# EAGLE design Control Board v1.1 (EAGLE 7.7.0)
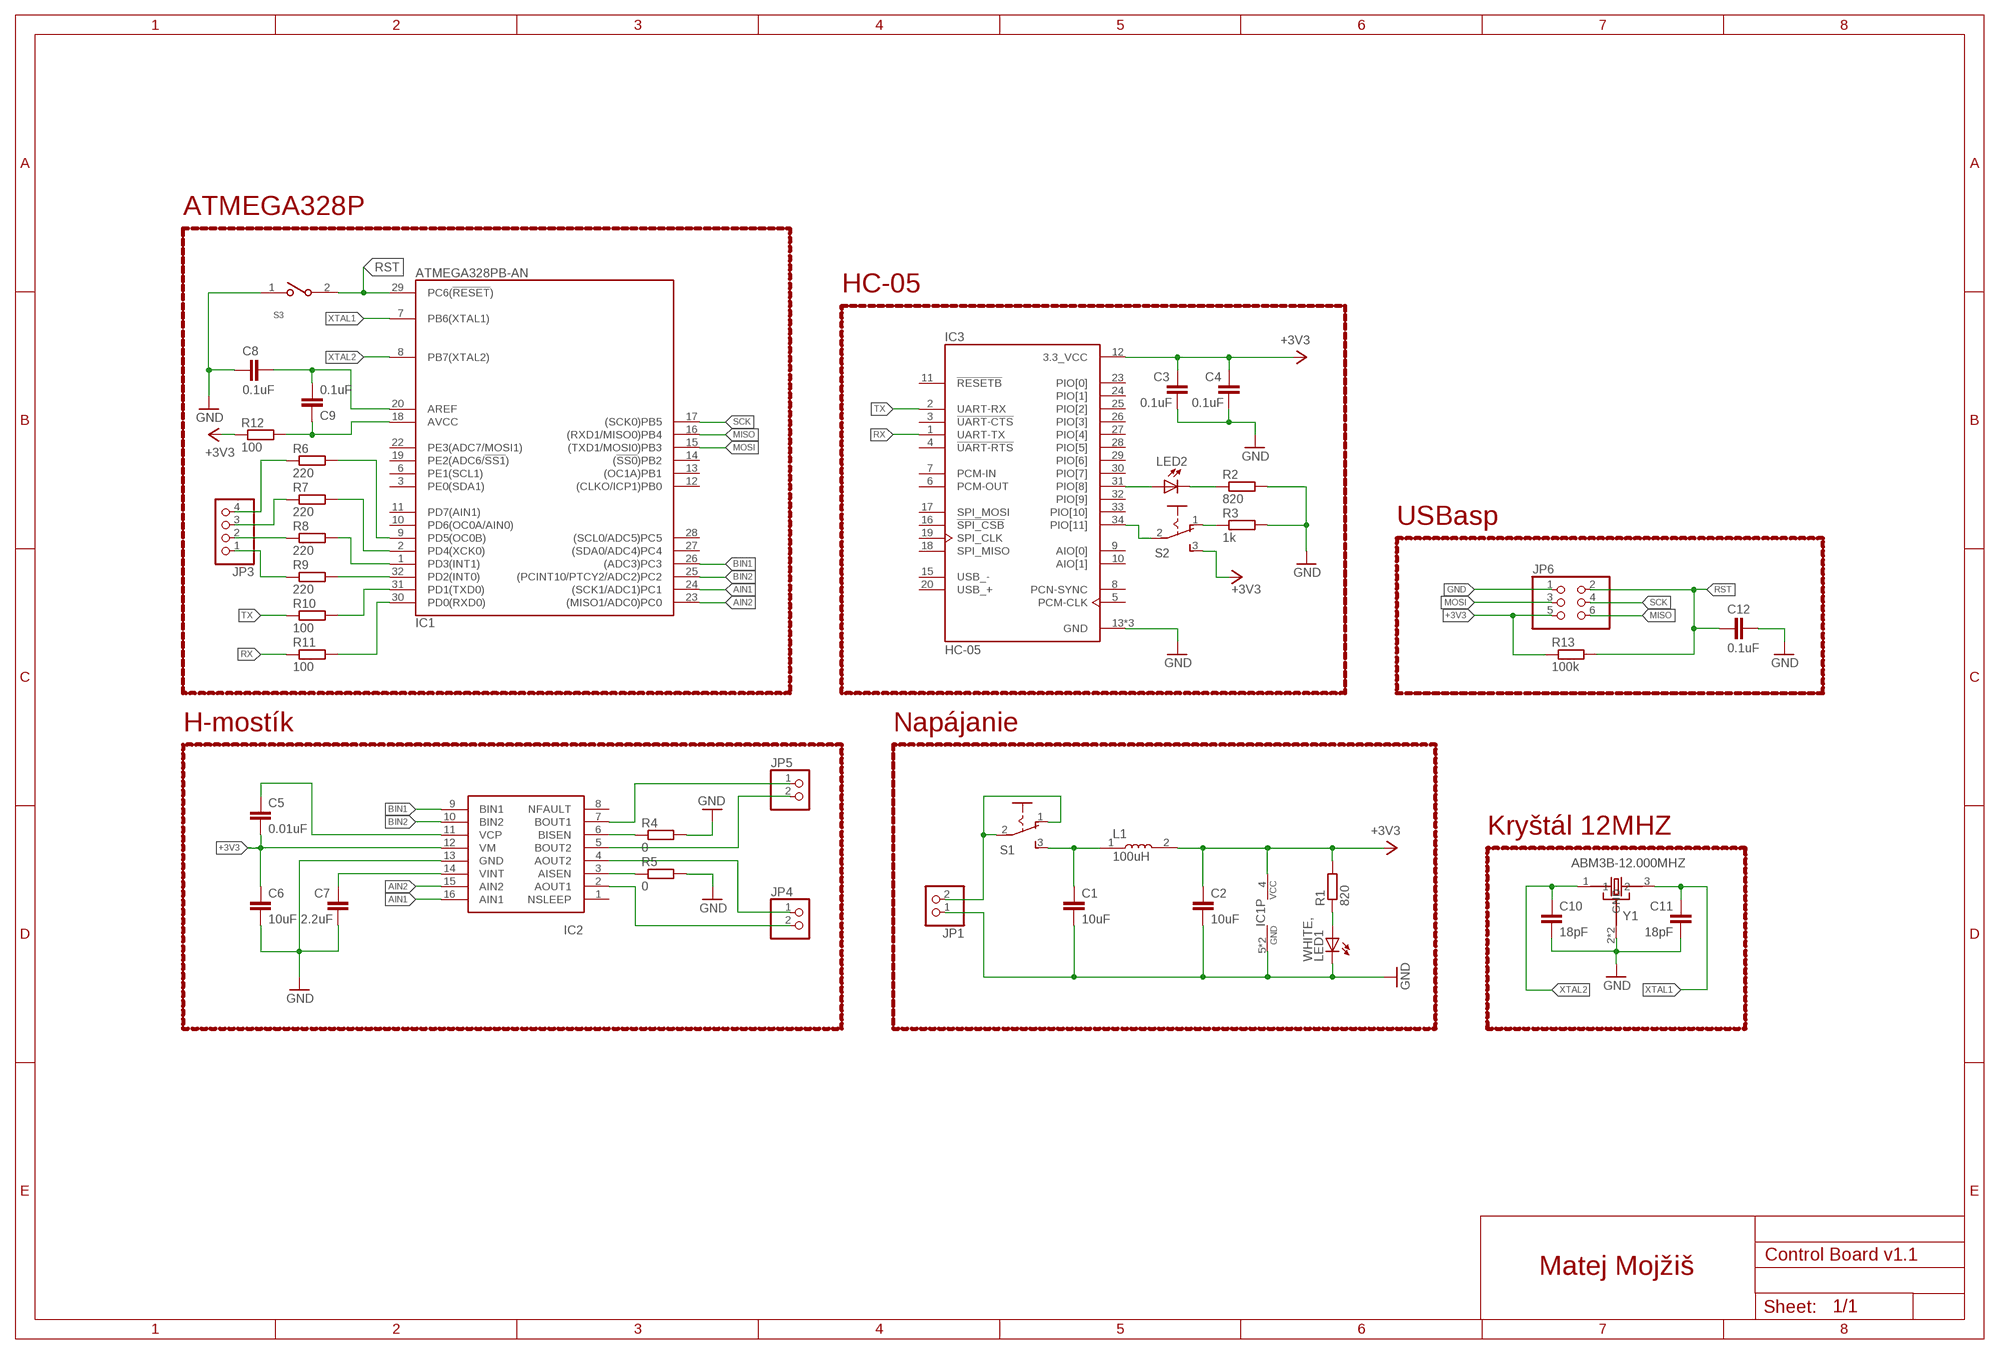
[diagram p0: schematic, sheet 1]

## Parts
C1  10uF  C-EUC0805  [C0805]
C2  10uF  C-EUC0805  [C0805]
C3  0.1uF  C-EUC0805  [C0805]
C4  0.1uF  C-EUC0805  [C0805]
C5  0.01uF  C-EUC0805  [C0805]
C6  10uF  C-EUC0805  [C0805]
C7  2.2uF  C-EUC0805  [C0805]
C8  0.1uF  C-EUC0805  [C0805]
C9  0.1uF  C-EUC0805  [C0805]
C10  18pF  C-EUC0805  [C0805]
C11  18pF  C-EUC0805  [C0805]
C12  0.1uF  C-EUC0805  [C0805]
IC1  ATMEGA328PB-AN  [QFP32_7X7_0.80]
IC2  DVR8833SUPERFICIAL  [PWP16]
IC3  HC-05  [XCVR_HC-05]
JP1  PINHD-1X2/90  [1X02/90]
JP3  PINHD-1X4  [1X04]
JP4  PINHD-1X2/90  [1X02/90]
JP5  PINHD-1X2/90  [1X02/90]
JP6  PINHD-2X3  [2X03]
L1  100uH  MLF2012C330KT000  [INDC2012X87N]
LED1  WHITE,  LEDCHIPLED_0805  [CHIPLED_0805]
LED2  RED  LEDCHIPLED_0805  [CHIPLED_0805]
R1  820  R-EU_R0805  [R0805]
R2  820  R-EU_R0805  [R0805]
R3  1k  R-EU_R0805  [R0805]
R4  0  R-EU_R0805  [R0805]
R5  0  R-EU_R0805  [R0805]
R6  220  R-EU_R0805  [R0805]
R7  220  R-EU_R0805  [R0805]
R8  220  R-EU_R0805  [R0805]
R9  220  R-EU_R0805  [R0805]
R10  100  R-EU_R0805  [R0805]
R11  100  R-EU_R0805  [R0805]
R12  100  R-EU_R0805  [R0805]
R13  100k  R-EU_R0805  [R0805]
S1  255SB  [255SB]
S2  255SB  [255SB]
S3  147873-2  [SW_147873-2]
Y1  ABM3B-12.000MHZ  ABM3B-8.000MHZ-B2-T  [OSCSC500X320X110-4N]

## Nets
3V7: C1.1 L1.1 S1.3(S)
+3V3: C2.1 C3.1 C4.1 C5.2 C6.1 IC1.4(VCC) IC2.12(VM) IC3.12(3.3_VCC) JP6.5 L1.2 R1.2 R12.1 R13.1 S2.3(S)
+3V7: JP1.2 S1.1(O) S1.2(P)
AIN1: IC1.24((SCK1/ADC1)PC1) IC2.16(AIN1)
AIN2: IC1.23((MISO1/ADC0)PC0) IC2.15(AIN2)
AISEN: IC2.3(AISEN) R5.1
AOUT1: IC2.2(AOUT1) JP4.2
AOUT2: IC2.4(AOUT2) JP4.1
AREF: C8.1 C9.2 IC1.20(AREF)
AVCC: C9.1 IC1.18(AVCC) R12.2
BACK: JP3.2 R8.1
BIN1: IC1.26((ADC3)PC3) IC2.9(BIN1)
BIN2: IC1.25((PCINT10/PTCY2/ADC2)PC2) IC2.10(BIN2)
BISEN: IC2.6(BISEN) R4.1
BOUT1: IC2.7(BOUT1) JP5.1
BOUT2: IC2.5(BOUT2) JP5.2
FRONT: JP3.1 R9.1
GND: C1.2 C2.2 C3.2 C4.2 C6.2 C7.2 C8.2 C10.2 C11.2 C12.1 IC1.5(GND) IC1.21(GND) IC2.13(GND) IC3.13(GND) IC3.21(GND) IC3.22(GND) JP1.1 JP6.1 LED1.C R2.2 R3.2 R4.2 R5.2 S3.1 Y1.2(GND) Y1.4(GND)
IN: LED1.A R1.1
INRX: IC1.30(PD0(RXD0)) R11.2
LED: LED2.C R2.1
LEFT: JP3.3 R7.1
MISO: IC1.16((RXD1/MISO0)PB4) JP6.6
MOSI: IC1.15((TXD1/MOSI0)PB3) JP6.3
OUTTX: IC1.31(PD1(TXD0)) R10.2
PD2: IC1.32(PD2(INT0)) R9.2
PD3: IC1.1(PD3(INT1)) R8.2
PD4: IC1.2(PD4(XCK0)) R7.2
PD5: IC1.9(PD5(OC0B)) R6.2
PIO8: IC3.31(PIO[8]) LED2.A
PIO11: IC3.34(PIO[11]) S2.2(P)
RIGHT: JP3.4 R6.1
RST: C12.2 IC1.29(PC6(!RESET!)) JP6.2 R13.2 S3.2
RX: IC3.1(UART-TX) R11.1
S: R3.1 S2.1(O)
SCK: IC1.17((SCK0)PB5) JP6.4
TX: IC3.2(UART-RX) R10.1
VCP: C5.1 IC2.11(VCP)
VINT: C7.1 IC2.14(VINT)
XTAL1: C11.1 IC1.7(PB6(XTAL1)) Y1.3
XTAL2: C10.1 IC1.8(PB7(XTAL2)) Y1.1
Unconnected: IC1.3(PE0(SDA1)) IC1.6(PE1(SCL1)) IC1.10(PD6(OC0A/AIN0)) IC1.11(PD7(AIN1)) IC1.12((CLKO/ICP1)PB0) IC1.13((OC1A)PB1) IC1.14((!SS0!)PB2) IC1.19(PE2(ADC6/!SS1!)) IC1.22(PE3(ADC7/MOSI1)) IC1.27((SDA0/ADC4)PC4) IC1.28((SCL0/ADC5)PC5) IC2.1(NSLEEP) IC2.8(NFAULT) IC3.3(!UART-CTS) IC3.4(!UART-RTS) IC3.5(PCM-CLK) IC3.6(PCM-OUT) IC3.7(PCM-IN) IC3.8(PCN-SYNC) IC3.9(AIO[0]) IC3.10(AIO[1]) IC3.11(!RESETB) IC3.15(USB_-) IC3.16(!SPI_CSB) IC3.17(SPI_MOSI) IC3.18(SPI_MISO) IC3.19(SPI_CLK) IC3.20(USB_+) IC3.23(PIO[0]) IC3.24(PIO[1]) IC3.25(PIO[2]) IC3.26(PIO[3]) IC3.27(PIO[4]) IC3.28(PIO[5]) IC3.29(PIO[6]) IC3.30(PIO[7]) IC3.32(PIO[9]) IC3.33(PIO[10])

## Notes on the sheet
- ATMEGA328P
- HC-05
- USBasp
- H-mostík | Napájanie
- Kryštál 12MHZ
- Matej Mojžiš

## Library data of the parts
C1-C12 = rcl:C-EU: CAPACITOR, European symbol
IC1 = atmel328new:ATMEGA328PB: 8-bit AVR Microcontroller 32kbytes flash 2kbytes SRAM 1kbyte EEPROM USART 8-channel 10 bit ADC
IC2 = personales:DVR8833
IC3 = HC-05:HC-05: Bluetooth to Serial Port Module; AVAILABILITY: Unavailable; DESCRIPTION: Bluetooth to Serial Port Module; MF: Bel Power solution; MP: HC-05; PACKAGE: SOIC-14; PRICE: None
JP1 JP4 JP5 = pinhead:PINHD-1X2: PIN HEADER
JP3 = pinhead:PINHD-1X4: PIN HEADER
JP6 = pinhead:PINHD-2X3: PIN HEADER
L1 = MLF2012C330KT000:MLF2012C330KT000: FIXED IND 33UH 5MA 1.1 OHM SMD Check prices <https://pricing.snapeda.com/parts/MLF2012C330KT000/TDK/view-part?ref=eda>; AVAILABILITY: Warning; DESCRIPTION: Fixed Ind 33uh 5ma 1.1 Ohm Smd; MF: TDK; MP: MLF2012C330KT000; PACKAGE: 0805 TDK; PRICE: None; PURCHASE-URL: https://pricing.snapeda.com/search/part/MLF2012C330KT000/?ref=eda
LED1 LED2 = led:LED: LED OSRAM: - CHIPLED LG R971, LG N971, LY N971, LG Q971, LY Q971, LO R971, LY R971 LH N974, LH R974 LS Q976, LO Q976, LY Q976 LO Q996 - Hyper CHIPLED LW Q18S LB Q993, LB Q99A, LB R99A - SideLED LS A670, LO A670, LY A670, LG A670, LP A670 LB A673, LV A673, LT A673, LW A673 LH A674 LY A675 LS A676, LA A676, LO A676, LY A676, LW A676 LS A679, LY A679, LG A679 - Hyper Micro SIDELED® LS Y876, LA Y876, LO Y876, LY Y876 LT Y87S - SmartLED LW L88C, LW L88S LB L89C, LB L89S, LG L890 LS L89K, LO L89K, LY L89K LS L896, LA L896, LO L896, LY L896 - TOPLED LS T670, LO T670, LY T670, LG T670, LP T670 LSG T670, LSP T670, LSY T670, LOP T670, LYG T670 LG T671, LOG T671, LSG T671 LB T673, LV T673, LT T673, LW T673 LH T674 LS T676, LA T676, LO T676, LY T676, LB T676, LH T676, LSB T676, LW T676 LB T67C, LV T67C, LT T67C, LS T67K, LO T67K, LY T67K, LW E67C LS E67B, LA E67B, LO E67B, LY E67B, LB E67C, LV E67C, LT E67C LW T67C LS T679, LY T679, LG T679 LS T770, LO T770, LY T770, LG T770, LP T770 LB T773, LV T773, LT T773, LW T773 LH T774 LS E675, LA E675, LY E675, LS T675 LS T776, LA T776, LO T776, LY T776, LB T776 LHGB T686 LT T68C, LB T68C - Hyper Mini TOPLED® LB M676 - Mini TOPLED Santana® LG M470 LS M47K, LO M47K, LY M47K Source: http://www.osram.convergy.de LUXEON: - LUMILED® LXK2-PW12-R00, LXK2-PW12-S00, LXK2-PW14-U00, LXK2-PW14-V00 LXK2-PM12-R00, LXK2-PM12-S00, LXK2-PM14-U00 LXK2-PE12-Q00, LXK2-PE12-R00, LXK2-PE12-S00, LXK2-PE14-T00, LXK2-PE14-U00 LXK2-PB12-K00, LXK2-PB12-L00, LXK2-PB12-M00, LXK2-PB14-N00, LXK2-PB14-P00, LXK2-PB14-Q00 LXK2-PR12-L00, LXK2-PR12-M00, LXK2-PR14-Q00, LXK2-PR14-R00 LXK2-PD12-Q00, LXK2-PD12-R00, LXK2-PD12-S00 LXK2-PH12-R00, LXK2-PH12-S00 LXK2-PL12-P00, LXK2-PL12-Q00, LXK2-PL12-R00 Source: www.luxeon.com KINGBRIGHT: KA-3528ASYC Source: www.kingbright.com
R1-R13 = rcl:R-EU_: RESISTOR, European symbol
S1 S2 = switch:255SB: SLIDING SWITCH Distributor Buerklin, 11G810
S3 = 147873-2:147873-2: SWITCH TACTILE SPST-NO 0.05A 24V Check prices <https://pricing.snapeda.com/parts/147873-2/TE%20Connectivity/view-part?ref=eda>; AVAILABILITY: Good; COMMENT: 147873-2; CONFIGURATION_POLE-THROW: Single Pole - Single Throw; CONTACT_CURRENT_RATING: 50 mA; DESCRIPTION: Switch Tactile OFF (ON) SPST Rectangular Button J-Bend 0.05A 24VDC 1.77N SMD T/R; MF: TE Connectivity; MP: 147873-2; PACKAGE: None; PRICE: None; PURCHASE-URL: https://pricing.snapeda.com/search/part/147873-2/?ref=eda
Y1 = ABM3B-8.000MHZ-B2-T:ABM3B-8.000MHZ-B2-T: Crystal 8MHz ±20ppm (Tol) ±50ppm (Stability) 18pF FUND 200Ohm 4-Pin CSMD T/R Check prices <https://pricing.snapeda.com/parts/ABM3B-8.000MHZ-B2-T/Abracon/view-part?ref=eda>; AVAILABILITY: Good; DESCRIPTION: 8MHz ±20ppm Crystal 18pF 200 Ohms 4-SMD, No Lead; MF: Abracon; MP: ABM3B-8.000MHZ-B2-T; PACKAGE: SMD-4 Abracon; PRICE: None; PURCHASE-URL: https://pricing.snapeda.com/search/part/ABM3B-8.000MHZ-B2-T/?ref=eda

## Board
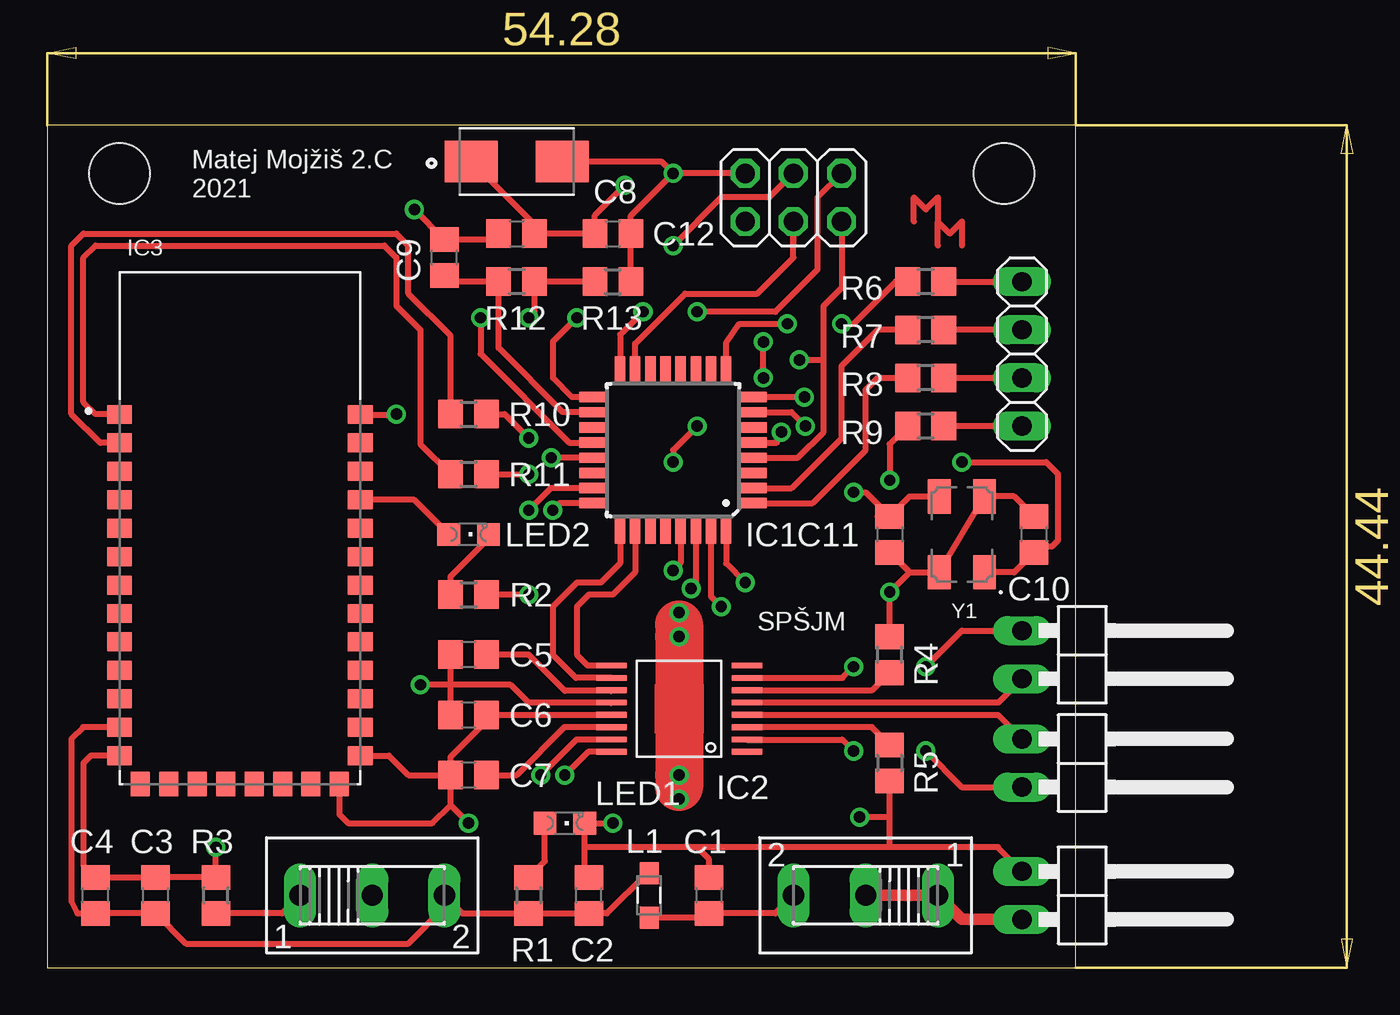
[diagram p1: board, top side]
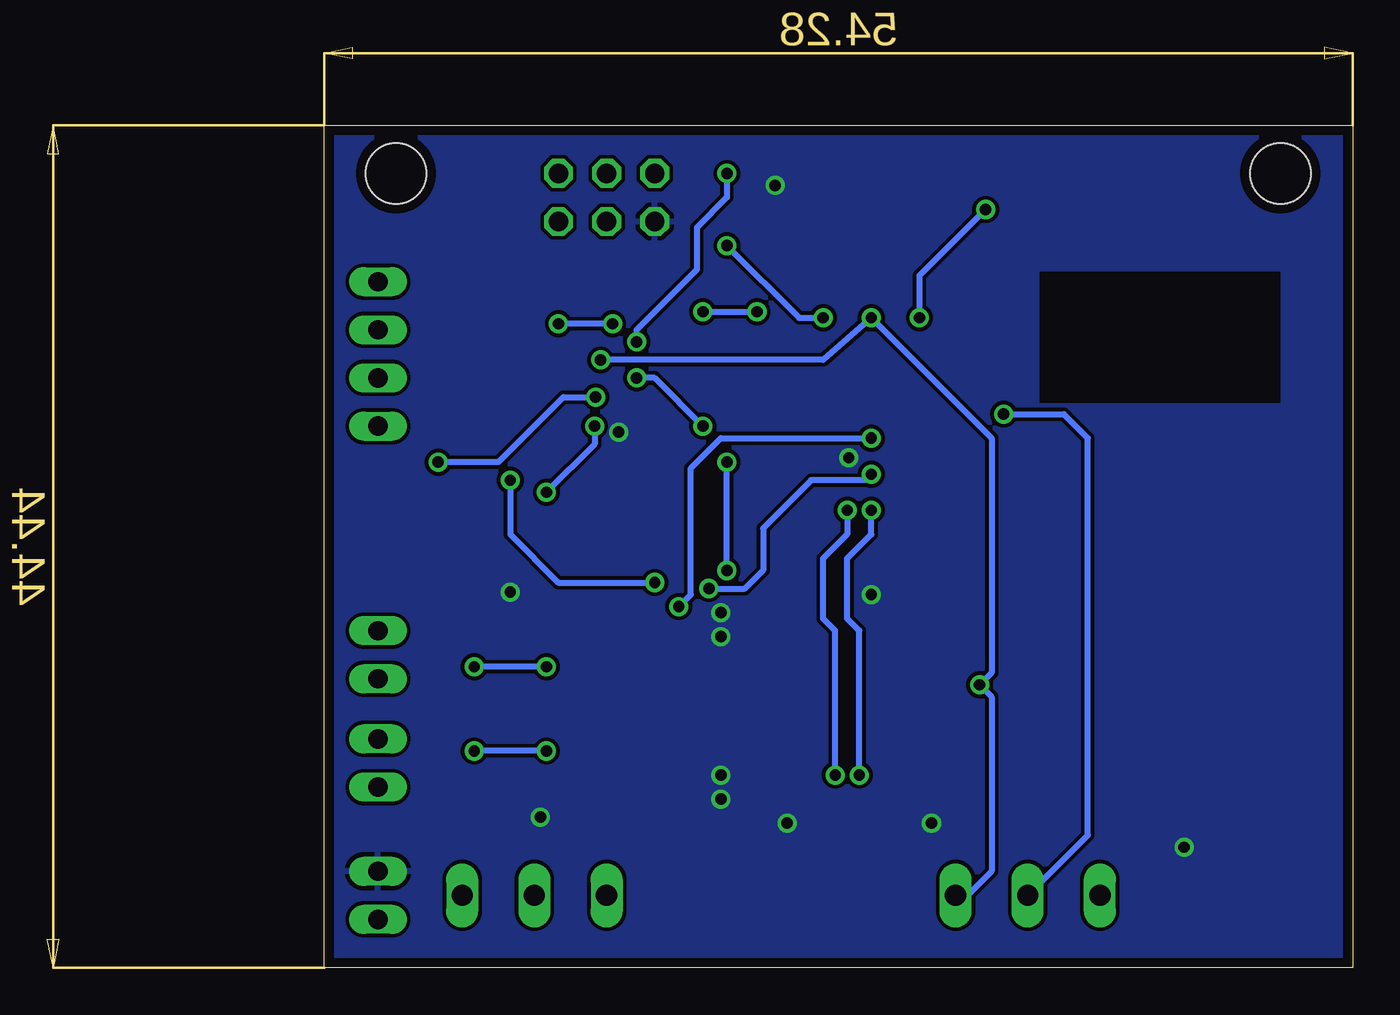
[diagram p2: board, bottom side, seen from below]

Size 54.28 x 44.44 mm. Coordinates in mm from the lower left corner, seen from the top.
Outline: 0,0 54.28,0 54.28,44.44 0,44.44 0,0
Copper layers (1*16): Top 0.035mm / dielectric 1.5mm / Bottom 0.035mm
Design rules "default *": minimum track width 10mil, minimum drill 20mil, track to track 8mil, track to pad 8mil, pad to pad 8mil, via to via 8mil, smd to smd 8mil, copper to edge 20mil, drill to drill 8mil, minimum pad ring 10mil, minimum via ring 8mil, stop-mask expansion 4mil, vias tented up to drill 0mil, thermal gap 10mil
Holes 3.2 mm at 3.81,41.91 50.48,41.91

### Footprints (pad centres in the part's own frame; a part is rotated, then mirrored left to right if it is on the bottom)
C0805 = smd 1.3 x 1.5: 1 -0.95,0; 2 0.95,0
QFP32_7X7_0.80 = smd 1.5 x 0.55: 1 -4.2,2.8; 2 -4.2,2; 3 -4.2,1.2; 4 -4.2,0.4; 5 -4.2,-0.4; 6 -4.2,-1.2; 7 -4.2,-2; 8 -4.2,-2.8; 17 4.2,-2.8; 18 4.2,-2; 19 4.2,-1.2; 20 4.2,-0.4; 21 4.2,0.4; 22 4.2,1.2; 23 4.2,2; 24 4.2,2.8 | smd 0.55 x 1.5: 9 -2.8,-4.2; 10 -2,-4.2; 11 -1.2,-4.2; 12 -0.4,-4.2; 13 0.4,-4.2; 14 1.2,-4.2; 15 2,-4.2; 16 2.8,-4.2; 25 2.8,4.2; 26 2,4.2; 27 1.2,4.2; 28 0.4,4.2; 29 -0.4,4.2; 30 -1.2,4.2; 31 -2,4.2; 32 -2.8,4.2
PWP16 = smd 0.305 x 1.6: 1 -1.95,-3.9; 2 -1.3,-3.9; 3 -0.65,-3.9; 4 0,-3.9; 5 0.65,-3.9; 6 1.3,-3.9; 7 1.95,-3.9; 8 2.6,-3.9; 9 2.6,3.25; 10 1.95,3.25; 11 1.3,3.25; 12 0.65,3.25; 13 0,3.25; 14 -0.65,3.25; 15 -1.3,3.25; 16 -1.95,3.25
XCVR_HC-05 = smd 1.3 x 1: 1 -6.35,6.325; 2 -6.35,4.825; 3 -6.35,3.325; 4 -6.35,1.825; 5 -6.35,0.325; 6 -6.35,-1.175; 7 -6.35,-2.675; 8 -6.35,-4.175; 9 -6.35,-5.675; 10 -6.35,-7.175; 11 -6.35,-8.675; 12 -6.35,-10.175; 13 -6.35,-11.675; 22 6.35,-11.675; 23 6.35,-10.175; 24 6.35,-8.675; 25 6.35,-7.175; 26 6.35,-5.675; 27 6.35,-4.175; 28 6.35,-2.675; 29 6.35,-1.175; 30 6.35,0.325; 31 6.35,1.825; 32 6.35,3.325; 33 6.35,4.825; 34 6.35,6.325 | smd 1 x 1.3: 14 -5.25,-13.175; 15 -3.75,-13.175; 16 -2.25,-13.175; 17 -0.75,-13.175; 18 0.75,-13.175; 19 2.25,-13.175; 20 3.75,-13.175; 21 5.25,-13.175
1X02/90 = drill 1.016 long: 1 -1.27,-3.81; 2 1.27,-3.81
1X04 = drill 1.016 long: 1 -3.81,0; 2 -1.27,0; 3 1.27,0; 4 3.81,0
2X03 = drill 1.016 octagon: 1 -2.54,-1.27; 2 -2.54,1.27; 3 0,-1.27; 4 0,1.27; 5 2.54,-1.27; 6 2.54,1.27
INDC2012X87N = smd 1.15 x 1: 1 -1.175,0; 2 1.175,0
CHIPLED_0805 = smd 1.2 x 1.2: A 0,-1.05; C 0,1.05
R0805 = smd 1.3 x 1.5: 1 -0.95,0; 2 0.95,0
255SB = drill 1.118 long: 1 -3.81,0; 2 0,0; 3 3.81,0
SW_147873-2 = smd 2.8 x 2.2: 1 -2.4,0; 2 2.4,0
OSCSC500X320X110-4N = smd 1.2 x 1.8: 1 -1.2,2; 2 -1.2,-2; 3 1.2,-2; 4 1.2,2

### Placement (x,y rotation side)
C1  34.92,3.81 90 top
C2  28.57,3.81 90 top
C3  5.71,3.81 90 top
C4  2.54,3.81 90 top
C5  22.23,16.51 180 top
C6  22.23,13.34 0 top
C7  22.23,10.16 180 top
C8  24.77,38.73 0 top
C9  20.95,37.47 90 top
C10  52.07,22.86 90 top
C11  44.45,22.86 270 top
C12  29.84,38.73 0 top
IC1  33.02,27.3 180 top
IC2  33.02,13.34 90 top
IC3  10.16,22.86 0 top
JP1  55.24,3.81 270 top
JP3  51.44,32.38 90 top
JP4  55.24,10.79 270 top
JP5  55.24,16.51 270 top
JP6  39.37,40.64 0 top
L1  31.75,3.81 90 top
LED1  27.3,7.62 270 top
LED2  22.23,22.86 270 top
R1  25.4,3.81 270 top
R2  22.23,19.68 0 top
R3  8.89,3.81 90 top
R4  44.45,16.51 90 top
R5  44.45,10.79 270 top
R6  46.35,36.2 180 top
R7  46.35,33.66 180 top
R8  46.35,31.11 180 top
R9  46.35,28.57 180 top
R10  22.23,29.21 0 top
R11  22.23,26.04 0 top
R12  24.77,36.2 180 top
R13  29.84,36.2 0 top
S1  43.18,3.81 180 top
S2  17.14,3.81 0 top
S3  24.77,42.55 0 top
Y1  48.26,22.86 180 top

### Tracks (layer width: path | path; a pad name or v marks a point on that pad's centre or on a via)
3V7
  Top 0.305: L1.1 34.7,2.63 C1.1 38.42,2.86 S1.3
+3V3  (via drill 0.6 pad 0.41)
  Top 0.305: L1.2 31.66,4.99 29.53,2.86 C2.1 R1.2 21.91,2.86 S2.3 20.95,3.17 19.05,1.27 7.3,1.27 C3.1 C4.1 1.58,2.86 1.27,3.49 1.27,12.06 1.89,12.69 IC3.12 | C6.1 21.27,14.92 | 21.27,14.92 C5.2 | IC2.12 29.75,13.97 25.4,13.97 24.45,14.92 21.27,14.92 | IC1.4 39.6,26.91 40.96,28.26 40.96,32.07 | 21.27,14.92 v19.68,14.92 | 40.96,32.07 40.96,34.92 41.91,35.88 JP6.5 | R13.1 R12.1 25.71,34.6 v25.4,34.29 | v39.69,32.07 40.96,32.07
  Bottom 0.305: S2.3 20.32,3.81 19.05,5.08 19.05,14.29 v19.68,14.92 19.05,15.56 19.05,27.94 v25.4,34.29 27.94,32.07 v39.69,32.07
+3V7
  Top 0.61: S1.2 S1.1 48.26,2.54 JP1.2
AIN1  (via drill 0.6 pad 0.41)
  Top 0.305: IC2.16 28.53,11.38 v27.3,10.16 | IC1.24 27.05,24.5 v26.67,24.13
  Bottom 0.305: v26.67,24.13 26.67,22.86 27.94,21.59 27.94,18.41 27.3,17.78 v27.3,10.16
AIN2  (via drill 0.6 pad 0.41)
  Top 0.305: IC2.15 27.91,12.04 v26.04,10.16 | IC1.23 26.57,25.3 v25.4,24.13
  Bottom 0.305: v25.4,24.13 25.4,22.86 26.67,21.59 26.67,18.41 26.04,17.78 v26.04,10.16
AISEN
  Top 0.305: R5.1 43.51,12.69 IC2.3
AOUT1  (via drill 0.6 pad 0.41)
  Top 0.305: IC2.2 41.94,12.04 v42.55,11.43 | JP4.2 48.26,9.53 v46.35,11.43
  Bottom 0.305: v42.55,11.43 v46.35,11.43
AOUT2
  Top 0.305: IC2.4 50.16,13.34 JP4.1
AREF  (via drill 0.6 pad 0.41)
  Top 0.305: v19.36,40.01 C9.2 23.5,38.41 C8.1 | IC1.20 27.54,27.7 22.86,32.38 v22.86,34.29
  Bottom 0.305: v19.36,40.01 22.86,36.51 v22.86,34.29
AVCC
  Top 0.305: IC1.18 27.21,29.3 23.82,32.7 R12.2 21.27,36.2 C9.1
BACK
  Top 0.305: R8.1 JP3.2
BIN1
  Top 0.305: IC2.9 28.52,15.94 27.94,16.51 27.94,19.05 28.57,19.68 29.84,19.68 31.02,20.86 IC1.26
BIN2
  Top 0.305: IC2.10 27.89,15.29 26.67,16.51 26.67,19.05 27.94,20.32 29.21,20.32 30.22,21.33 IC1.25
BISEN
  Top 0.305: IC2.6 43.52,14.63 R4.1
BOUT1  (via drill 0.6 pad 0.41)
  Top 0.305: IC2.7 41.95,15.29 v42.55,15.88 | JP5.1 48.26,17.78 v46.35,15.88
  Bottom 0.305: v42.55,15.88 v46.35,15.88
BOUT2
  Top 0.305: JP5.2 50.18,13.98 IC2.5
FRONT
  Top 0.305: JP3.1 R9.1
GND  (via drill 0.6 pad 0.41)
  Top 0.305: C2.2 28.36,4.98 28.36,6.35 | C1.2 34.92,5.71 34.29,6.35 | 34.29,6.35 28.36,6.35 | JP1.1 50.16,6.35 44.45,6.35 | 44.45,6.35 34.29,6.35 | IC3.22 18.02,11.19 19.05,10.16 C7.2 | IC3.13 2.29,11.19 1.91,10.79 1.91,5.39 C4.2 C3.2 R3.2 v8.89,6.35 | C11.2 45.5,20.86 | C10.2 51.02,24.86 Y1.2 Y1.4 45.5,20.86 | IC2.13 C6.2 23.18,13.02 21.27,11.12 C7.2 | IC3.21 15.41,8.09 15.88,7.62 20.32,7.62 21.27,8.57 | S3.1 25.71,39.2 C8.2 C12.1 28.89,39.69 v30.48,41.27 | v25.4,19.68 R2.2 | 21.27,8.57 C7.2 | 21.27,8.57 v22.23,7.62 | 44.45,6.35 44.45,7.94 | 44.45,7.94 R5.2 | 44.45,7.94 v42.86,7.94 | v29.84,7.62 LED1.C 28.36,6.35 | 45.5,20.86 v44.45,19.81 R4.2 | IC1.21 v26.59,26.91 | IC1.5 38.5,27.7 v38.73,28.26
  Top 2.54: 33.34,18.1 v33.34,17.46 v33.34,10.16 33.34,9.53
  other vias: 33.34,8.89 33.34,18.73
  pour Bottom: 0,44.45 0,0 54.29,0 54.29,44.45
IN
  Top 0.305: R1.1 26.25,5.62 LED1.A
INRX  (via drill 0.6 pad 0.41)
  Top 0.305: IC1.30 34.22,20.25 v33.97,20 | R11.2 v25.4,26.04
  Bottom 0.305: v33.97,20 32.07,20 31.11,20.95 31.11,23.18 28.57,25.72 25.72,25.72 v25.4,26.04
LED
  Top 0.305: R2.1 21.27,20.64 23.27,22.64 LED2.C
LEFT
  Top 0.305: JP3.3 R7.1
MISO  (via drill 0.6 pad 0.41)
  Top 0.305: JP6.6 40.64,40.64 40.64,36.83 38.42,34.61 v34.29,34.61 | v31.43,34.61 30.22,33.4 IC1.16
  Bottom 0.305: v34.29,34.61 v31.43,34.61
MOSI
  Top 0.305: IC1.15 31.02,32.92 33.66,35.56 37.47,35.56 39.37,37.47 JP6.3 39.37,38.1
NAME
  Top 0.305: 45.72,39.37 45.72,40.64 46.35,40.01 46.99,40.64 46.99,39.37 | 46.99,38.1 46.99,39.37 | 46.99,39.37 47.62,38.73 48.26,39.37 48.26,38.1
OUTTX  (via drill 0.6 pad 0.41)
  Top 0.305: IC1.31 35.02,19.59 v35.56,19.05 | R10.2 24.13,29.21 v25.4,27.94
  Bottom 0.305: v35.56,19.05 34.92,19.68 34.92,26.35 33.34,27.94 v25.4,27.94
PD2  (via drill 0.6 pad 0.41)
  Top 0.305: IC1.32 35.82,21.33 v36.83,20.32 | R9.2 44.45,27.62 v44.45,25.72
  Bottom 0.305: v44.45,25.72 44.45,22.86 41.91,20.32 v36.83,20.32
PD3
  Top 0.305: IC1.1 40.38,24.5 43.18,27.3 43.18,30.48 43.81,31.11 R8.2
PD4
  Top 0.305: IC1.2 39.27,25.3 41.91,27.94 41.91,31.75 43.81,33.66 R7.2
PD5  (via drill 0.6 pad 0.41)
  Top 0.305: IC1.9 35.82,32.96 36.51,33.97 v39.05,33.97 | v41.91,33.97 42.55,33.97 44.77,36.2 R6.2
  Bottom 0.305: v39.05,33.97 v41.91,33.97
PIO8
  Top 0.305: LED2.A 19.35,24.68 IC3.31
PIO11  (via drill 0.6 pad 0.41)
  Top 0.305: IC3.34 18.39,29.18 v18.41,29.21
  Bottom 0.305: S2.2 13.97,6.99 13.97,27.94 15.24,29.21 v18.41,29.21
RIGHT
  Top 0.305: R6.1 JP3.4
RST  (via drill 0.6 pad 0.41)
  Top 0.305: IC1.29 33.42,21.36 v33.02,20.95 | S3.2 32.38,42.55 v33.02,41.91 | R13.2 C12.2 30.8,39.69 v33.02,41.91 | JP6.2 v33.02,41.91 | v34.29,28.57 33.02,27.3 v33.02,26.67 | v37.78,31.11 v37.78,33.02
  Bottom 0.305: v33.02,41.91 33.02,40.64 34.61,39.05 34.61,36.83 37.78,33.66 v37.78,33.02 | v33.02,20.95 v33.02,26.67 | v34.29,28.57 36.83,31.11 v37.78,31.11
RX
  Top 0.305: IC3.1 3.79,29.21 2.54,29.21 1.91,29.84 1.91,37.47 2.54,38.1 17.78,38.1 18.41,37.47 18.41,34.92 19.68,33.66 19.68,27.62 R11.1
S
  Top 0.305: S2.1 12.38,2.86 R3.1
SCK  (via drill 0.6 pad 0.41)
  Top 0.305: IC1.17 27.68,30.11 26.67,31.11 26.67,33.02 v27.94,34.29 | JP6.4 38.1,40.64 35.56,40.64 v33.02,38.1
  Bottom 0.305: v33.02,38.1 29.21,34.29 v27.94,34.29
TX
  Top 0.305: IC3.2 2.79,27.68 1.27,29.21 1.27,38.1 1.91,38.73 18.41,38.73 19.05,38.1 19.05,35.56 21.27,33.34 R10.1
VCP
  Top 0.305: IC2.11 29.74,14.61 27.3,14.61 25.4,16.51 C5.1
VINT
  Top 0.305: C7.1 24.77,10.16 27.3,12.7 29.75,12.7 IC2.14
XTAL1  (via drill 0.6 pad 0.41)
  Top 0.305: C11.1 45.5,24.86 Y1.3 | 44.45,24.13 C11.1 | 43.82,23.81 C11.1 | IC1.7 39.27,29.3 v40.01,28.57 | v42.55,25.08 43.18,25.08 C11.1
  Bottom 0.305: v40.01,28.57 40.01,27.62 v42.55,25.08 42.7,24.92
XTAL2  (via drill 0.6 pad 0.41)
  Top 0.305: Y1.1 51.02,20.86 C10.1 52.38,22.23 53.02,22.23 53.34,22.54 53.34,26.04 52.7,26.67 v48.26,26.67 | v39.95,30.11 IC1.8
  Bottom 0.305: v39.95,30.11 41.65,30.11 45.09,26.67 v48.26,26.67

### Text on the board
tNames: Matej Mojžiš 2.C / 2021 | SPŠJM